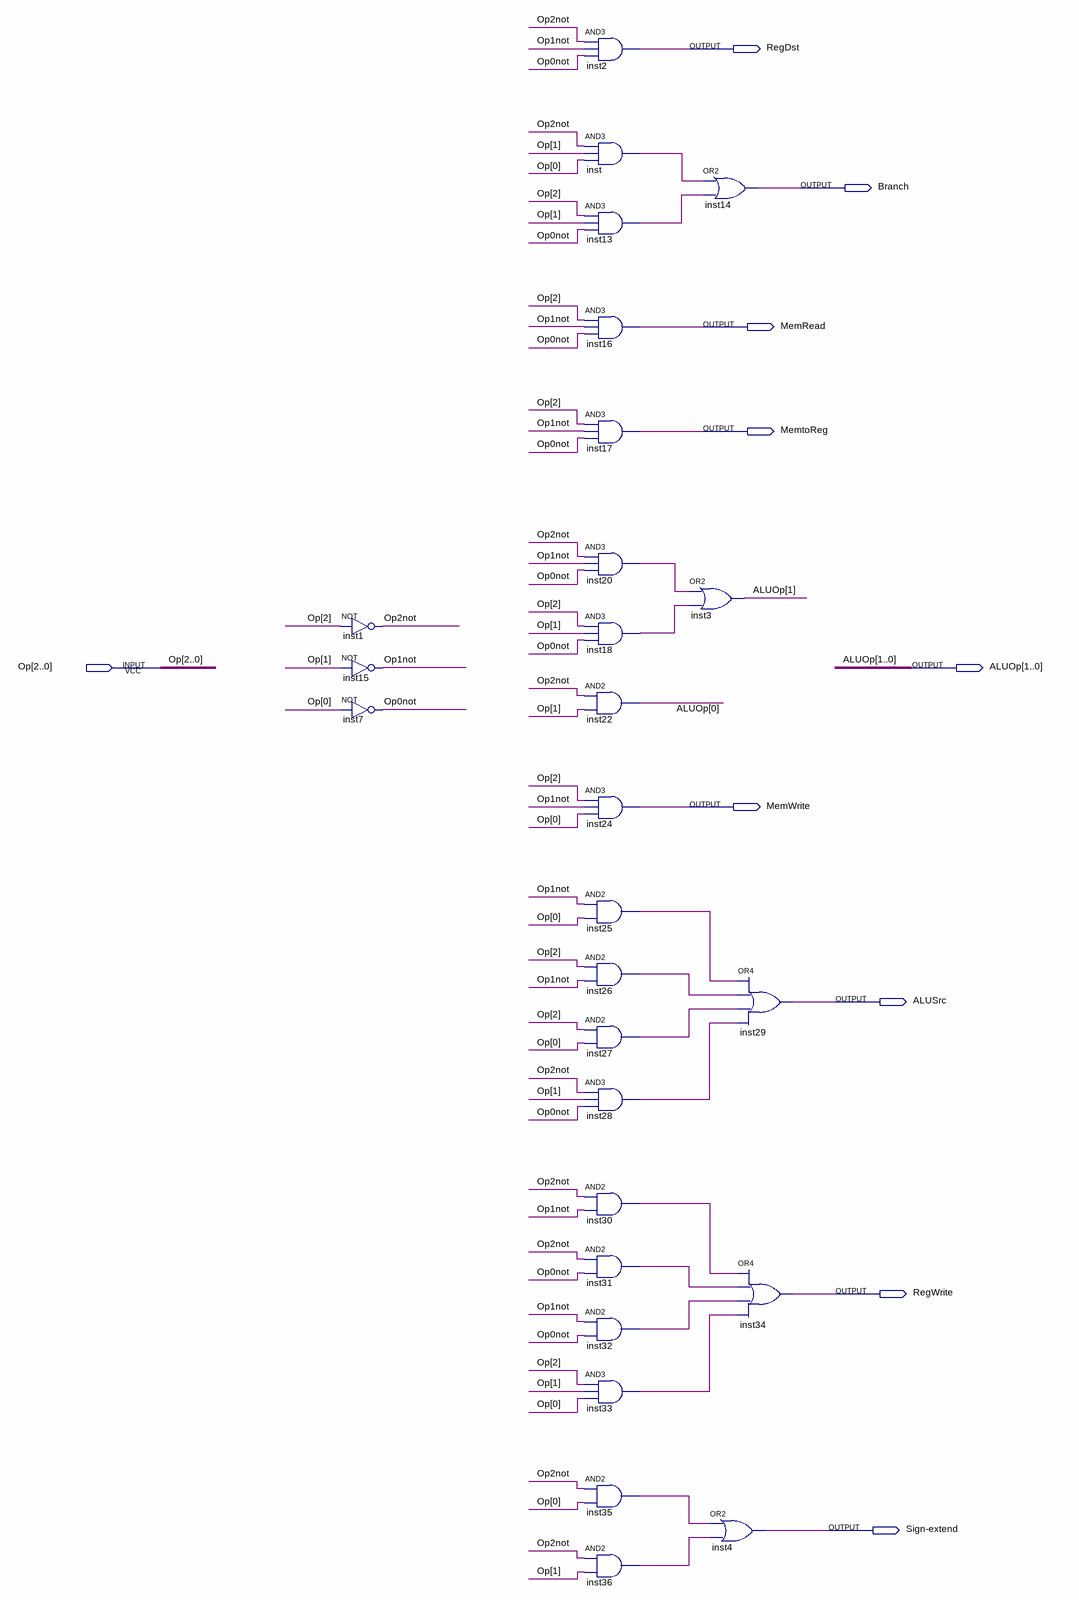
[diagram p0: schematic sheet]
// Quartus schematic control_unit.bdf as structural Verilog: 27 symbols, 10 pins
module control_unit (
  input  [2:0] Op,
  output RegDst,
  output Branch,
  output MemRead,
  output MemtoReg,
  output [1:0] ALUOp,
  output MemWrite,
  output ALUSrc,
  output RegWrite,
  output \Sign-extend 
);

  wire inst13_out, inst18_out, inst20_out, inst25_out, inst26_out, inst27_out, inst28_out, inst30_out,
       inst31_out, inst32_out, inst33_out, inst35_out, inst36_out, inst_out, Op0not, Op1not, Op2not;

  not inst1 (Op2not, Op[2]);
  not inst15 (Op1not, Op[1]);
  not inst7 (Op0not, Op[0]);
  and inst2 (RegDst, Op2not, Op1not, Op0not);
  and inst (inst_out, Op2not, Op[1], Op[0]);
  and inst13 (inst13_out, Op[2], Op[1], Op0not);
  and inst16 (MemRead, Op[2], Op1not, Op0not);
  and inst17 (MemtoReg, Op[2], Op1not, Op0not);
  and inst20 (inst20_out, Op2not, Op1not, Op0not);
  and inst18 (inst18_out, Op[2], Op[1], Op0not);
  and inst22 (ALUOp[0], Op2not, Op[1]);
  and inst24 (MemWrite, Op[2], Op1not, Op[0]);
  and inst25 (inst25_out, Op1not, Op[0]);
  and inst26 (inst26_out, Op[2], Op1not);
  and inst27 (inst27_out, Op[2], Op[0]);
  and inst28 (inst28_out, Op2not, Op[1], Op0not);
  and inst30 (inst30_out, Op2not, Op1not);
  and inst31 (inst31_out, Op2not, Op0not);
  and inst32 (inst32_out, Op1not, Op0not);
  and inst33 (inst33_out, Op[2], Op[1], Op[0]);
  and inst35 (inst35_out, Op2not, Op[0]);
  and inst36 (inst36_out, Op2not, Op[1]);
  or inst14 (Branch, inst_out, inst13_out);
  or inst3 (ALUOp[1], inst20_out, inst18_out);
  or inst4 (\Sign-extend , inst35_out, inst36_out);
  or inst29 (ALUSrc, inst25_out, inst26_out, inst27_out, inst28_out);
  or inst34 (RegWrite, inst30_out, inst31_out, inst32_out, inst33_out);
endmodule
